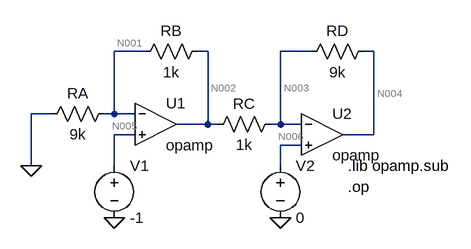
[diagram p0: schematic pag8es22.asc]
pag8es22.asc, the LTspice schematic file:
Version 4
SHEET 1 880 680
WIRE 128 16 80 16
WIRE 224 16 208 16
WIRE 384 16 336 16
WIRE 480 16 464 16
WIRE -16 112 -48 112
WIRE 80 112 80 16
WIRE 80 112 64 112
WIRE 112 112 80 112
WIRE 224 128 224 16
WIRE 224 128 176 128
WIRE 240 128 224 128
WIRE 336 128 336 16
WIRE 336 128 320 128
WIRE 368 128 336 128
WIRE 112 144 80 144
WIRE 480 144 480 16
WIRE 480 144 432 144
WIRE 368 160 336 160
WIRE -48 192 -48 112
WIRE 80 192 80 144
WIRE 336 192 336 160
FLAG -48 192 0
FLAG 80 272 0
FLAG 336 272 0
SYMBOL res -32 128 R270
WINDOW 0 32 56 VTop 2
WINDOW 3 0 56 VBottom 2
SYMATTR InstName RA
SYMATTR Value 9k
SYMBOL OpAmps\\opamp 144 64 R0
SYMATTR InstName U1
SYMBOL voltage 80 176 R0
SYMATTR InstName V1
SYMATTR Value -1
SYMBOL res 112 32 R270
WINDOW 0 32 56 VTop 2
WINDOW 3 0 56 VBottom 2
SYMATTR InstName RB
SYMATTR Value 1k
SYMBOL res 224 144 R270
WINDOW 0 32 56 VTop 2
WINDOW 3 0 56 VBottom 2
SYMATTR InstName RC
SYMATTR Value 1k
SYMBOL res 368 32 R270
WINDOW 0 32 56 VTop 2
WINDOW 3 0 56 VBottom 2
SYMATTR InstName RD
SYMATTR Value 9k
SYMBOL OpAmps\\opamp 400 80 R0
SYMATTR InstName U2
SYMBOL voltage 336 176 R0
SYMATTR InstName V2
SYMATTR Value 0
TEXT 440 192 Left 2 !.lib opamp.sub
TEXT 440 224 Left 2 !.op

The netlist it stands for:
* pag8es22.asc
RA 0 N001 9k
XU1 N001 N005 N002 opamp Aol=100K GBW=10Meg  ; pins invin noninvin out
V1 N005 0 -1
RB N001 N002 1k
RC N002 N003 1k
RD N003 N004 9k
XU2 N003 N006 N004 opamp Aol=100K GBW=10Meg  ; pins invin noninvin out
V2 N006 0 0
.lib opamp.sub
.op
.backanno
.end

* Results of the author's LTspice run, read from the files saved beside the schematic
* Operating Point:
*   V(n001) = -1 V
*   V(n002) = -1.111 V
*   V(n005) = -1 V
*   V(n003) = -100 µV
*   V(n004) = 9.999 V
*   V(n006) = 0 V
*   I(Rd) = -1.111 mA
*   I(Rc) = -1.111 mA
*   I(Rb) = 111.1 µA
*   I(Ra) = 111.1 µA
*   I(V2) = 0 A
*   I(V1) = 0 A
*   Ix(u1:3) = 1.222 mA
*   Ix(u2:3) = -1.111 mA